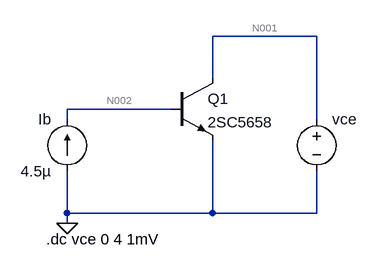
[diagram p0: schematic Draft2.asc]
Draft2.asc, the LTspice schematic file:
Version 4.1
SHEET 1 880 680
WIRE 336 64 176 64
WIRE 176 128 176 64
WIRE 112 176 -48 176
WIRE -48 192 -48 176
WIRE 336 192 336 64
WIRE -48 336 -48 272
WIRE 176 336 176 224
WIRE 176 336 -48 336
WIRE 336 336 336 272
WIRE 336 336 176 336
WIRE -48 352 -48 336
FLAG -48 352 0
SYMBOL npn 112 128 R0
SYMATTR InstName Q1
SYMATTR Value 2SC5658
SYMBOL current -48 272 R180
WINDOW 0 24 80 Left 2
WINDOW 3 24 0 Left 2
WINDOW 123 0 0 Left 0
WINDOW 39 0 0 Left 0
SYMATTR InstName Ib
SYMATTR Value 4.5µ
SYMBOL voltage 336 176 R0
SYMATTR InstName vce
SYMATTR Value ""
TEXT -80 376 Left 2 !.dc vce 0 4 1mV

The netlist it stands for:
* Draft2.asc
Q1 N001 N002 0 0 2SC5658
Ib 0 N002 4.5µ
vce N001 0
.model NPN NPN
.model PNP PNP
.lib standard.bjt
.dc vce 0 4 1mV
.backanno
.end

* Results of the author's LTspice run, read from the files saved beside the schematic
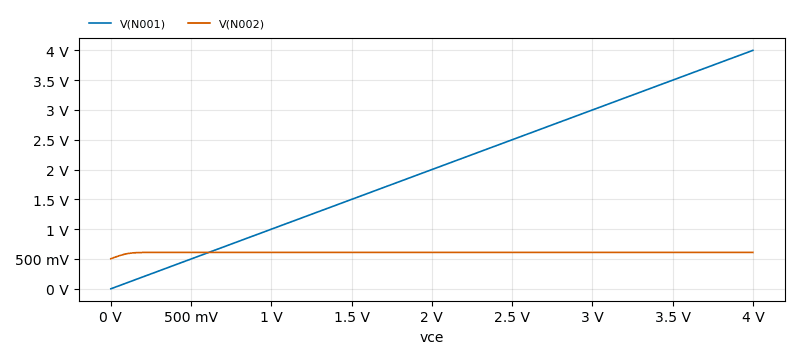
[diagram p1: DC transfer characteristic of Draft2.asc, plotted from the saved traces]
* DC transfer characteristic, 1 run:
*   V(N001): 0 V at vce=0 V, 4 V at vce=4 V, min 0 V, max 4 V
*   V(N002): 505.5 mV at vce=0 V, 610.7 mV at vce=4 V, min 505.5 mV, max 610.7 mV